# Altium schematic sheet RPi.SchDoc: Motherboard-RPi
size A4; Author: Patryk Bujak; DrawnBy: Patryk Bujak; DocumentNumber: 12; Revision: 1.0; SheetNumber: 5; SheetTotal: 10
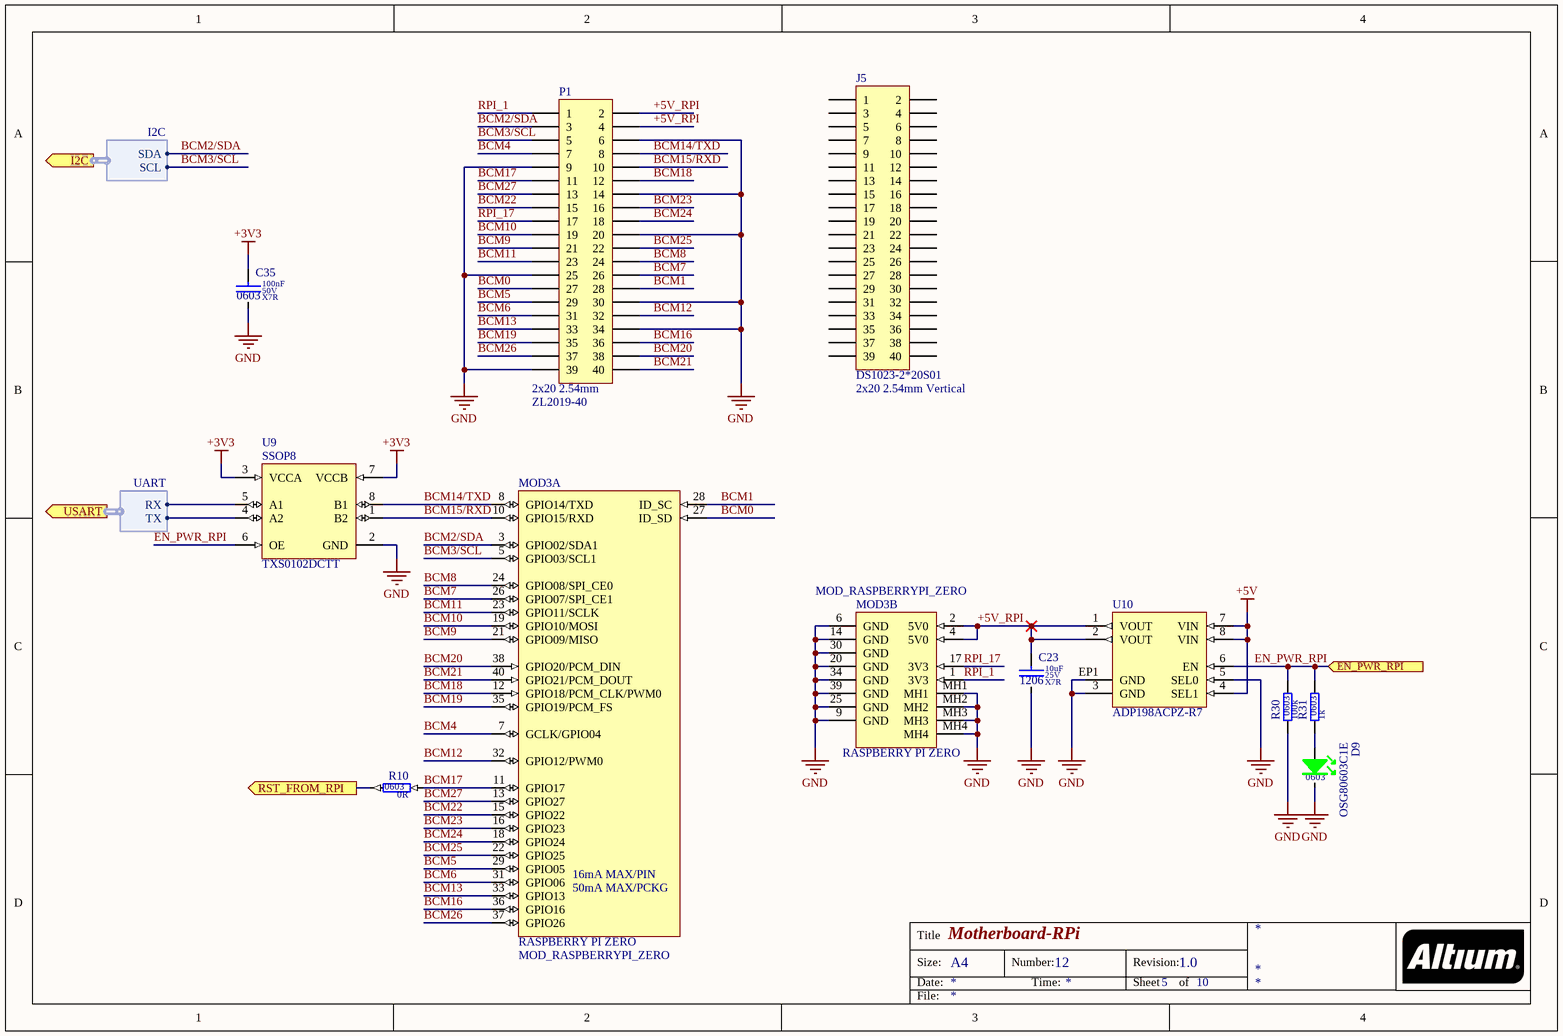
[diagram p0: RPi.SchDoc]

## Parts
C23  value 10uF  Dielectric: X7R  Voltage: 25V  SCH_Footprint: 1206  [C_1206_3216]  (hidden comment: Ceramic X7R)
C35  value 100nF  Dielectric: X7R  Voltage: 50V  SCH_Footprint: 0603  [C_0603_1608]  (hidden comment: Ceramic X7R)
D9  value OSG80603C1E  SCH_Footprint: 0603  [OL_0603_1608]  (hidden comment: Green led)
J5  value DS1023-2*20S01  SCH_Footprint: 2x20 2.54mm Vertical  [J_HEADER_2x20_2.54_VERTICAL]  (hidden comment: Goldpin female straight)
MOD3  value RASPBERRY PI ZERO  [MOD_RASPBERRYPI_ZERO]  (hidden comment: MOD_RASPBERRYPI_ZERO)  (parts A,B of 2)
P1  value ZL2019-40  SCH_Footprint: 2x20 2.54mm  [P_HEADER_2x20_2.54_HIGH]  (hidden comment: Goldpin)
R10  value 0R  SCH_Footprint: 0603  [R_0603_1608]  (hidden comment: Resistor)
R30  value 100k  SCH_Footprint: 0603  [R_0603_1608]  (hidden comment: Resistor)
R31  value 1k  SCH_Footprint: 0603  [R_0603_1608]  (hidden comment: Resistor)
U9  value TXS0102DCTT  SCH_Footprint: SSOP8  [SSOP8_3x3]  (hidden comment: 2-Bit Bidirectional Voltage-Level Shifter for Open-Drain and Push-Pull Application 8-VSSOP -40 to 85)
U10  value ADP198ACPZ-R7  SCH_Footprint: LFCSP8  [LFCSP-8-10]  (hidden comment: high-side load switch)

## Ports
EN_PWR_RPI (in), I2C (out, harness I2C), RST_FROM_RPI (out), USART (out, harness UART)

## Harnesses
I2C: SDA, SCL
UART: RX, TX

## Nets
+3V3: C35.1 U9.3(VCCA) U9.7(VCCB)
+5V: U10.4(SEL1) U10.7(VIN) U10.8(VIN)
GND: C23.2 C35.2 D9.1(K) MOD3.6(GND) MOD3.9(GND) MOD3.14(GND) MOD3.20(GND) MOD3.25(GND) MOD3.30(GND) MOD3.34(GND) MOD3.39(GND) MOD3.MH1 MOD3.MH2 MOD3.MH3 MOD3.MH4 P1.6 P1.9 P1.14 P1.20 P1.25 P1.30 P1.34 P1.39 R30.1 U9.2(GND) U10.3(GND) U10.5(SEL0) U10.EP1(GND)
+5V_RPI: C23.1 MOD3.2(5V0) MOD3.4(5V0) P1.2 P1.4 U10.1(VOUT) U10.2(VOUT)
BCM0: MOD3.27(ID_SD) P1.27
BCM1: MOD3.28(ID_SC) P1.28
BCM2/SDA: MOD3.3(GPIO02/SDA1) P1.3 ; port I2C.SDA
BCM3/SCL: MOD3.5(GPIO03/SCL1) P1.5 ; port I2C.SCL
BCM4: MOD3.7(GCLK/GPIO04) P1.7
BCM5: MOD3.29(GPIO05) P1.29
BCM6: MOD3.31(GPIO06) P1.31
BCM7: MOD3.26(GPIO07/SPI_CE1) P1.26
BCM8: MOD3.24(GPIO08/SPI_CE0) P1.24
BCM9: MOD3.21(GPIO09/MISO) P1.21
BCM10: MOD3.19(GPIO10/MOSI) P1.19
BCM11: MOD3.23(GPIO11/SCLK) P1.23
BCM12: MOD3.32(GPIO12/PWM0) P1.32
BCM13: MOD3.33(GPIO13) P1.33
BCM14/TXD: MOD3.8(GPIO14/TXD) P1.8 U9.8(B1)
BCM15/RXD: MOD3.10(GPIO15/RXD) P1.10 U9.1(B2)
BCM16: MOD3.36(GPIO16) P1.36
BCM17: MOD3.11(GPIO17) P1.11 R10.1
BCM18: MOD3.12(GPIO18/PCM_CLK/PWM0) P1.12
BCM19: MOD3.35(GPIO19/PCM_FS) P1.35
BCM20: MOD3.38(GPIO20/PCM_DIN) P1.38
BCM21: MOD3.40(GPIO21/PCM_DOUT) P1.40
BCM22: MOD3.15(GPIO22) P1.15
BCM23: MOD3.16(GPIO23) P1.16
BCM24: MOD3.18(GPIO24) P1.18
BCM25: MOD3.22(GPIO25) P1.22
BCM26: MOD3.37(GPIO26) P1.37
BCM27: MOD3.13(GPIO27) P1.13
EN_PWR_RPI: R30.2 R31.2 U9.6(OE) U10.6(EN) ; port EN_PWR_RPI
RPI_1: MOD3.1(3V3) P1.1
RPI_17: MOD3.17(3V3) P1.17
RST_FROM_RPI: R10.2 ; port RST_FROM_RPI
NetD9_2: D9.2(A) R31.1
NetU9_4: U9.4(A2) ; port USART.TX
NetU9_5: U9.5(A1) ; port USART.RX

Not connected (* = marked no-connect by the designer): J5 1 2 3 4 5 6 7 8 9 10 11 12 13 14 15 16 17 18 19 20 21 22 23 24 25 26 27 28 29 30 31 32 33 34 35 36 37 38 39 40

## Notes on the sheet
- Title
- Size:
- Date:
- A4
- Number:
- Time:
- Revision:
- Sheet
- of
- File:
- (in symbol MOD_RASPBERRYPI_ZERO, part A) 16mA MAX/PIN; 50mA MAX/PCKG

## Library data of the parts
C23 = C_10uF_25V_X7R_1206_10: Capacitor; Manufacturer: Samsung Electro-Mechanics; Manufacturer Part Number: CL31B106KAHNNNE; Tolerance (%): 10; Part Number: C_10uF_25V_X7R_1206_10; HelpURL: http://www.tme.eu/pl/Document/4a42202b32dab16128fe107dd69598cc/samsung-chip-cap.pdf; Supplier 1: TME; Supplier Part Number 1: CL31B106KAHNNNE; Supplier 2: RS Components; Supplier 3: Farnell; Supplier 4: Mouser; Supplier 5: Digi-Key; Supplier 6: LCSC
C35 = C_100nF_50V_X7R_0603_5: Capacitor; Manufacturer: Samsung; Manufacturer Part Number: CL10B104JB8NNNC; Tolerance (%): 5; Part Number: C_100nF_50V_X7R_0603_5; HelpURL: http://www.tme.eu/pl/Document/4a42202b32dab16128fe107dd69598cc/samsung-chip-cap.pdf; Supplier 1: TME; Supplier Part Number 1: CL10B104JB8NNNC; Supplier 2: RS Components; Supplier Part Number 2: 7665455; Supplier 3: Farnell; Supplier 4: Mouser; Supplier 5: Digi-Key; Supplier Part Number 5: 1276-1033-1-ND; Supplier 6: LCSC; Supplier Part Number 6: C24452
D9 = OL_G_0603_OSG80603C1E: LED GREEN; Manufacturer: Optosupply; Part Number: OL_G_0603_OSG80603C1E; Manufacturer Part Number: OSG80603C1E; Supplier 1: TME; Supplier Part Number 1: OSG80603C1E; Supplier 2: RS Components; Supplier 3: Farnell; Supplier 4: Mouser; Supplier 5: Digi-Key; Supplier 6: LCSC
J5 = J_HEADER_2x20_2.54_VERTICAL: Pin Header; Manufacturer: Connfly; Part Number: J_HEADER_2x20_2.54_VERTICAL; HelpURL: http://www.tme.eu/pl/Document/efd0203e2d3a140765df98191085ea88/DS1023.pdf; Manufacturer Part Number: DS1023-2*20S01; Supplier 1: TME; Supplier Part Number 1: ZL262-40DG; Supplier 2: RS Components; Supplier 3: Farnell; Supplier 4: Mouser; Supplier 5: Digi-Key; Supplier 6: LCSC
P1 = P_HEADER_2x20_2.54_HIGH: Pin Header; Manufacturer: Ninigi; Part Number: P_HEADER_2x20_2.54_HIGH; HelpURL: -; Manufacturer Part Number: ZL2019-40; Supplier 1: TME; Supplier Part Number 1: ZL2019-2X20; Supplier 2: RS Components; Supplier 3: Farnell; Supplier 4: Mouser; Supplier 5: Digi-Key; Supplier 6: LCSC
R10 = R_0R_0603_5: Manufacturer: Samsung; Manufacturer Part Number: RC1608J000CS; Voltage: 50V; Power: 100mW; Tolerance: 5%; Part Number: R_0R_0603_5; HelpURL: http://www.samsungsem.com/kr/support/product-search/chip-resistor/RC1608J000CS.jsp; Supplier 1: TME; Supplier 2: RS Components; Supplier 3: Farnell; Supplier 4: Mouser; Supplier 5: Digi-Key; Supplier Part Number 5: 1276-3510-1-ND
R30 = R_100k_0603_1: Manufacturer: Royalohm; Manufacturer Part Number: 0603SAF1003T5E; Voltage: 50V; Power: 100mW; Tolerance: 1%; Part Number: R_100k_0603_1; HelpURL: http://www.tme.eu/pl/Document/b315665a56acbc42df513c99b390ad98/ROYALOHM-THICKFILM.pdf; Supplier 1: TME; Supplier Part Number 1: SMD0603-100K-1%; Supplier 2: RS Components; Supplier 3: Farnell; Supplier 4: Mouser; Supplier Part Number 4: 667-ERJ-3EKF1003V; Supplier 5: Digi-Key; Supplier Part Number 5: P100KHCT-ND; Supplier 6: LCSC
R31 = R_1k_0603_1: Manufacturer: Vishay; Manufacturer Part Number: CRCW06031K00FKEA; Voltage: 75V; Power: 100mW; Tolerance: 1%; Part Number: R_1k_0603_1; HelpURL: http://www.farnell.com/datasheets/2310790.pdf?_ga=2.256888843.1690599162.1548417389-1379097396.1542296996&_gac=1.262631934.1547230258.Cj0KCQiAmuHhBRD0ARIsAFWyPwhX8HcvXnM3tA0ZBodZLzDIjH2ZxLpjT5LWo9bad_HPRbU8LfPq44UaAhEwEALw_wcB; Supplier 1: TME; Supplier 2: RS Components; Supplier Part Number 2: 678-9875P; Supplier 3: Farnell; Supplier Part Number 3: 1469740; Supplier 4: Mouser; Supplier Part Number 4: 71-CRCW0603-1.0K-E3; Supplier 5: Digi-Key; Supplier Part Number 5: 541-1.00KHCT-ND; Supplier 6: LCSC
U9 = U_TXS0102DCTT: Manufacturer: Texas Instruments; Part Number: U_TXS0102DCTT; HelpURL: http://www.ti.com/lit/ds/symlink/txs0102.pdf; Manufacturer Part Number: TXS0102DCTT; Supplier 1: TME; Supplier 2: RS Components; Supplier Part Number 2: 7098912P; Supplier 3: Farnell; Supplier Part Number 3: 2098018; Supplier 4: Mouser; Supplier Part Number 4: 595-TXS0102DCTT; Supplier 5: Digi-Key; Supplier Part Number 5: 296-32603-1-ND; Supplier 6: LCSC
U10 = U_ADP198ACPZ-R7: Manufacturer: Analog Devices; Part Number: U_ADP198ACPZ-R7; HelpURL: https://datasheet.octopart.com/ADP198ACBZ-11-R7-Analog-Devices-datasheet-10979622.pdf; Manufacturer Part Number: ADP198ACPZ-R7; Supplier 1: TME; Supplier 2: RS Components; Supplier Part Number 2: 153-3184; Supplier 3: Farnell; Supplier Part Number 3: 2457351; Supplier 4: Mouser; Supplier Part Number 4: 584-ADP198ACPZ-R7; Supplier 5: Digi-Key; Supplier Part Number 5: ADP198ACPZ-R7CT-ND; Supplier 6: LCSC
MOD3 = MOD_RASPBERRYPI_ZERO: Part Number: MOD_RASPBERRYPI_ZERO; SCH_Footprint: MOD_RASPBERRYPI_ZERO; HelpURL: https://cdn.sparkfun.com/assets/learn_tutorials/6/7/6/PiZero_1.pdf; Manufacturer: Raspberry Pi; Manufacturer Part Number: RASPBERRY PI ZERO; Supplier 1: TME; Supplier 2: RS Components; Supplier 3: Farnell; Supplier 4: Mouser; Supplier 5: Digi-Key; Supplier 6: LCSC